# EAGLE design KBV2R20 (EAGLE 5.10)
DIGIKEY: S1064-ND; DIGIKEY#: PS1240P02CT3; MOUSER: PS1240P02CT3; MOUSER#: 263-1.0K-RC; NEWARK#: 89H0684

## Sheet 1 of 2
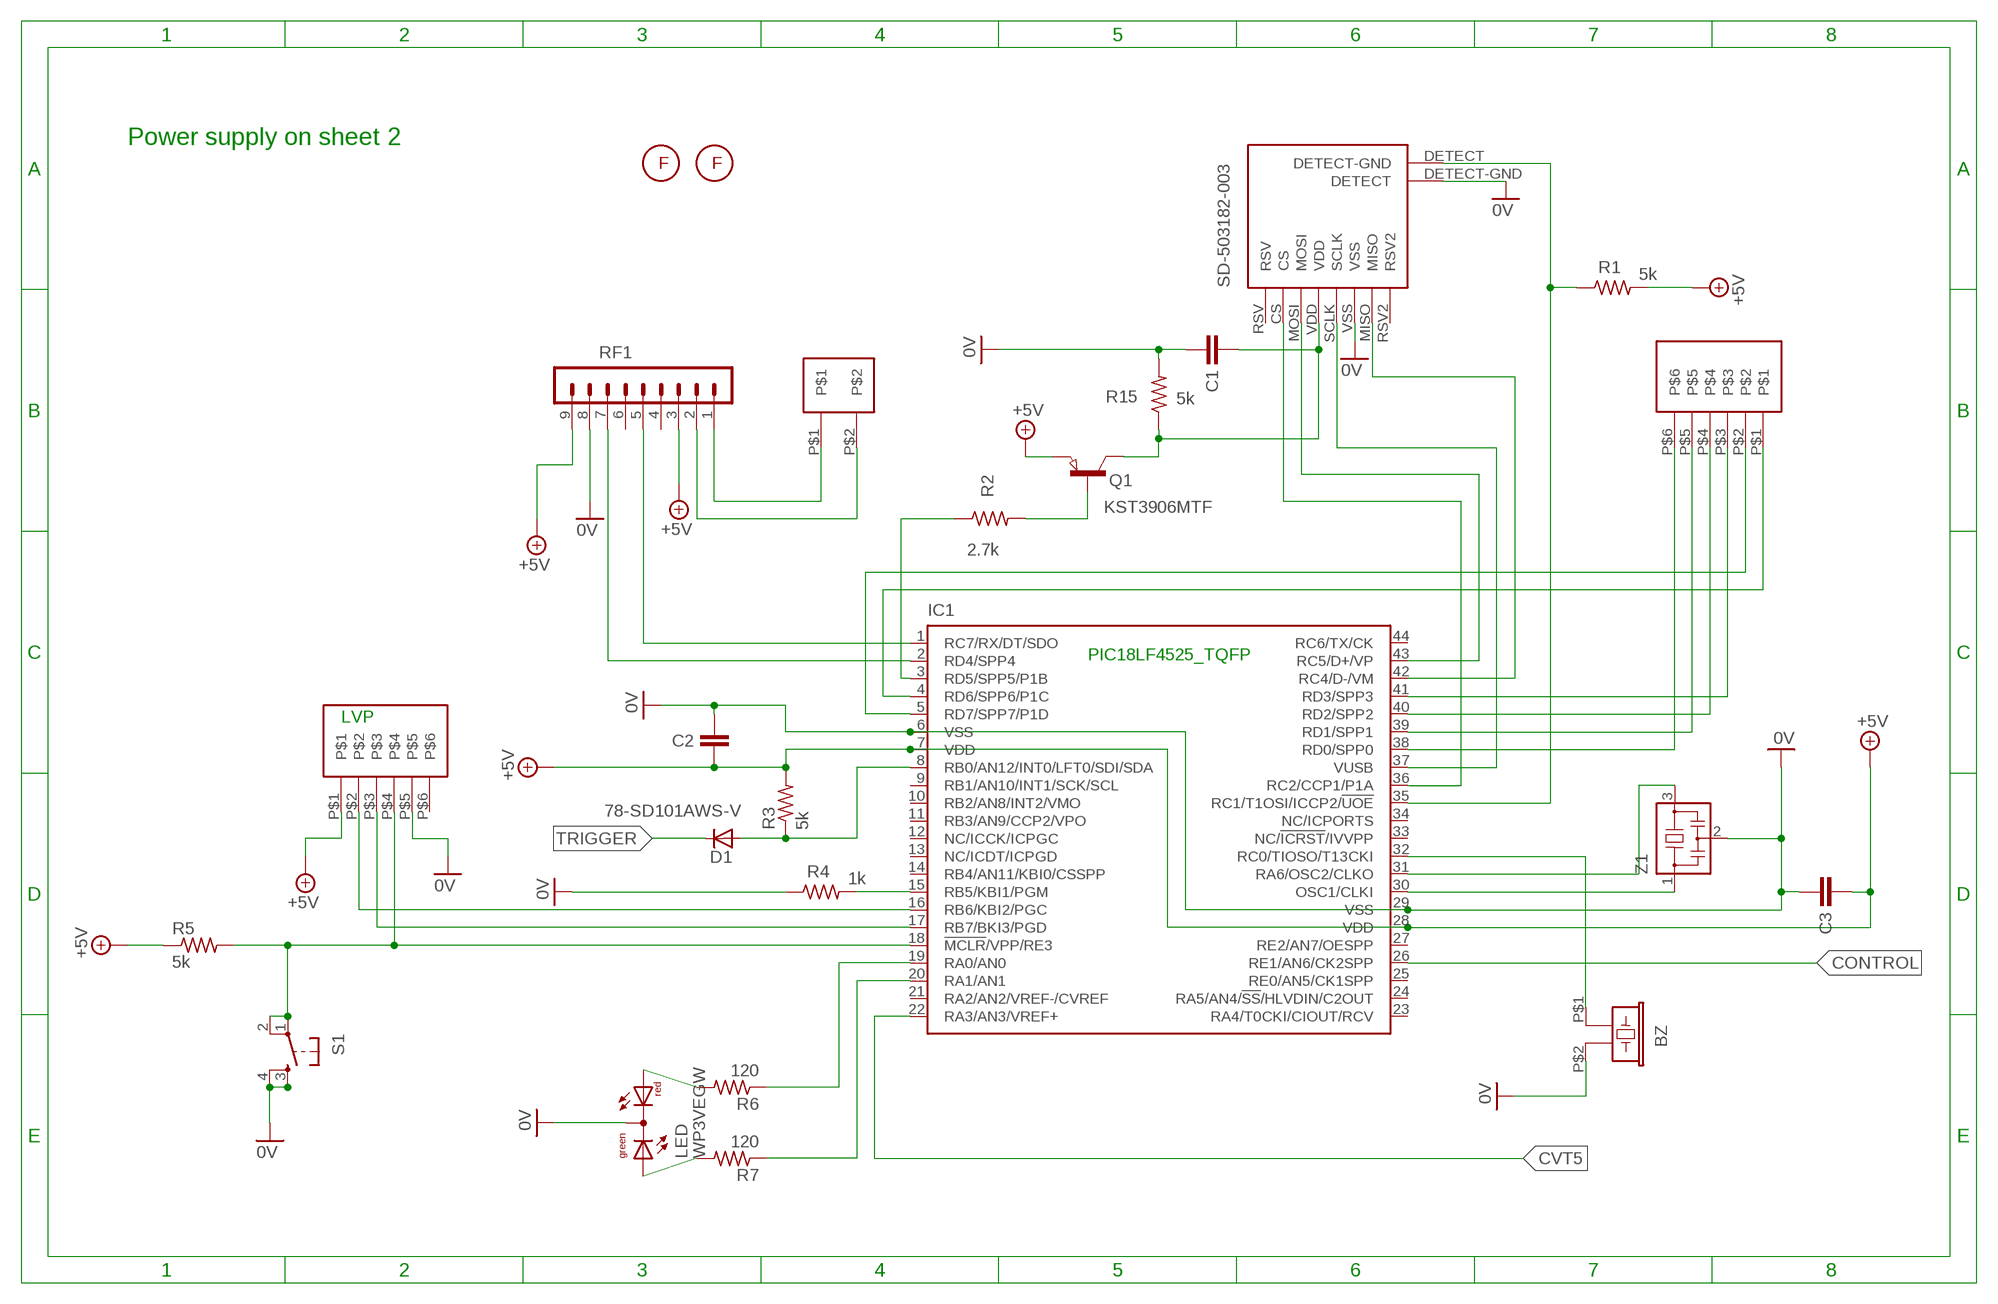
[diagram p0: schematic, sheet 1]

### Parts
BZ  PS1240P02CT3  HP1360A  [HP1360A]
C1  .1 uf  C-EUC0805K  [C0805K]
C2  .1 uf  C-EUC0805K  [C0805K]
C3  .1 uf  C-EUC0805K  [C0805K]
D1  78-SD101AWS-V  DIODE-SOD323-W  [SOD323-W]
EC-B  EZC06DRXH_BOTTOM  [EZC06DRXH_BOTTOM]
EC-T  EZC06DRXH_TOP  [EZC06DRXH_TOP]
FM1  FIDUCIAL2MMCIRCLE  [FIDUCIAL_2MMCIRCLE]
FM2  FIDUCIAL2MMCIRCLE  [FIDUCIAL_2MMCIRCLE]
IC1  PIC18F4525_TQFP Newark 89H0684  PIC18F4550_TQFP  [TQFP44]
L1  RC1  2PINPAD  [2PINPAD]
LED  WP3VEGW  [DUOLED-A-3MM]
Q1  KST3906MTF  PNP-TRANSISTOR_SOT23  [SOT23]
R1  5k  R-US_R0805  [R0805]
R2  2.7k  R-US_R0805  [R0805]
R3  5k  R-US_R0805  [R0805]
R4  1k  R-US_R0805  [R0805]
R5  5k  R-US_R0805  [R0805]
R6  120  R-US_R0805  [R0805]
R7  120  R-US_R0805  [R0805]
R15  5k  R-US_R0805  [R0805]
RF1  MA09-1  [MA09-1]
S1  DTS-6  [DTS-6]
SD1  SD-503182-003R  [SD-503182-003]
Z1  CSTCR4M00G53-R0  CSTCR6M00G53Z  [CSTCR6M]

### Nets
+5V: C2.2 C3.2 EC-T.P$1 IC1.7(VDD) IC1.28(VDD) Q1.2(E) R1.2 R3.2 R5.1 RF1.3 RF1.9 ; also sheet 2
CONTROL: IC1.26(RE1/AN6/CK2SPP) ; also sheet 2
CVT5: IC1.22(RA3/AN3/VREF+) ; also sheet 2
GND [GND]: BZ.P$2 C1.1 C2.1 C3.1 EC-T.P$5 IC1.6(VSS) IC1.29(VSS) LED.2(C) R4.1 R15.2 RF1.8 S1.3 S1.4 SD1.DETECT-GND(DETECT) SD1.VSS Z1.2 ; supply symbol labelled 0V ; also sheet 2
N$1: C1.2 Q1.3(C) R15.1 SD1.VDD
N$3: IC1.30(OSC1/CLKI) Z1.1
N$4: BZ.P$1 IC1.32(RC0/TIOSO/T13CKI)
N$5: L1.P$2 RF1.2
N$6: L1.P$1 RF1.1
N$7: IC1.3(RD5/SPP5/P1B) R2.1
N$8: Q1.1(B) R2.2
N$10: IC1.19(RA0/AN0) R6.1
N$11: IC1.20(RA1/AN1) R7.1
N$14: IC1.15(RB5/KBI1/PGM) R4.2
N$15: EC-T.P$3 IC1.17(RB7/BKI3/PGD)
N$17: EC-T.P$4 IC1.18(!MCLR!/VPP/RE3) R5.2 S1.1 S1.2
N$18: EC-T.P$2 IC1.16(RB6/KBI2/PGC)
N$19: IC1.31(RA6/OSC2/CLKO) Z1.3
N$20: IC1.1(RC7/RX/DT/SDO) RF1.5
N$21: IC1.2(RD4/SPP4) RF1.7
N$22: EC-B.P$1 IC1.4(RD6/SPP6/P1C)
N$23: IC1.42(RC4/D-/VM) SD1.MISO
N$24: LED.3(AG) R7.2
N$25: LED.1(AR) R6.2
N$26: IC1.37(VUSB) SD1.SCLK
N$30: EC-B.P$2 IC1.5(RD7/SPP7/P1D)
N$31: EC-B.P$3 IC1.41(RD3/SPP3)
N$32: EC-B.P$4 IC1.40(RD2/SPP2)
N$33: EC-B.P$5 IC1.39(RD1/SPP1)
N$34: EC-B.P$6 IC1.38(RD0/SPP0)
N$35: IC1.36(RC2/CCP1/P1A) SD1.CS
N$36: IC1.35(RC1/T1OSI/ICCP2/!UOE) R1.1 SD1.DETECT(DETECT-GND)
N$37: IC1.43(RC5/D+/VP) SD1.MOSI
RB4: D1.A IC1.8(RB0/AN12/INT0/LFT0/SDI/SDA) R3.1
TRIGGER: D1.C ; also sheet 2
Unconnected: EC-T.P$6 IC1.9(RB1/AN10/INT1/SCK/SCL) IC1.10(RB2/AN8/INT2/VMO) IC1.11(RB3/AN9/CCP2/VPO) IC1.12(NC/ICCK/ICPGC) IC1.13(NC/ICDT/ICPGD) IC1.14(RB4/AN11/KBI0/CSSPP) IC1.21(RA2/AN2/VREF-/CVREF) IC1.23(RA4/T0CKI/CIOUT/RCV) IC1.24(RA5/AN4/!SS!/HLVDIN/C2OUT) IC1.25(RE0/AN5/CK1SPP) IC1.27(RE2/AN7/OESPP) IC1.33(NC/!ICRST!/IVVPP) IC1.34(NC/ICPORTS) IC1.44(RC6/TX/CK) RF1.4 RF1.6 SD1.RSV SD1.RSV2

### Notes on the sheet
- Power supply on sheet 2
- PIC18LF4525_TQFP
- LVP

## Sheet 2 of 2
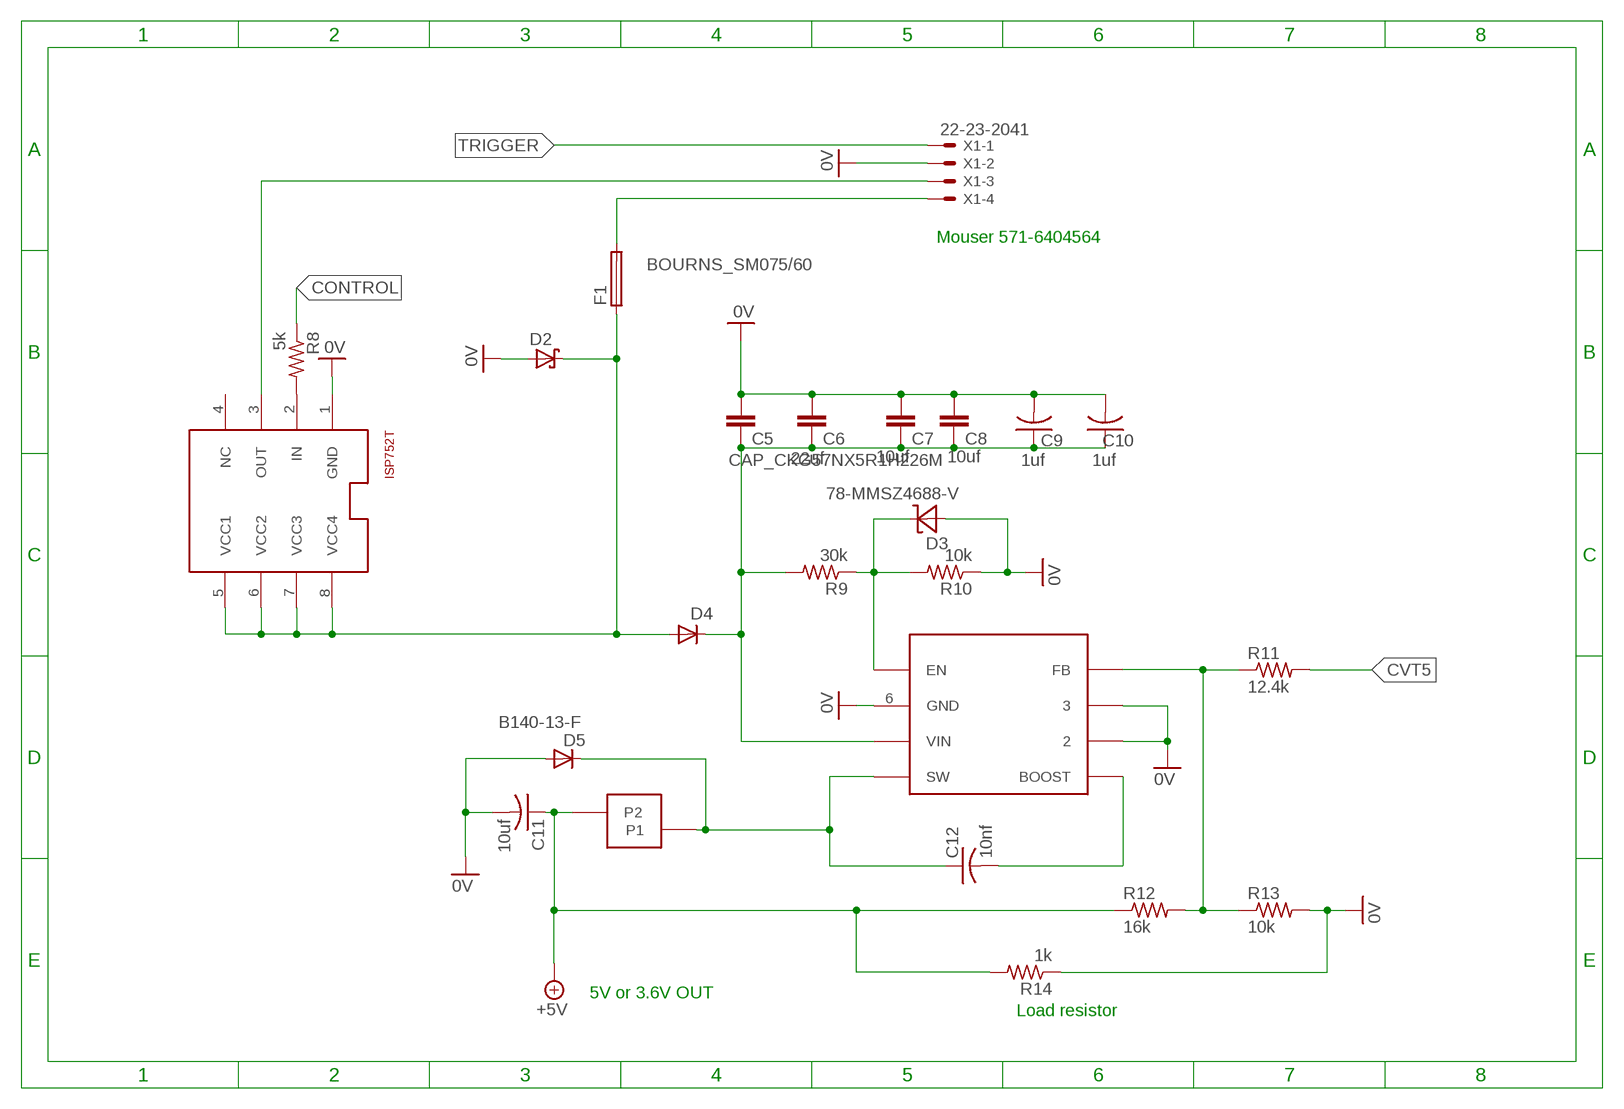
[diagram p1: schematic, sheet 2]

### Parts
C5  CAP_CKG57NX5R1H226M  [CKG57]
C6  22uf  CAP_CKG57NX5R1H226M  [CKG57]
C7  10uf  C-EUC1210  [C1210]
C8  10uf  C-EUC1210  [C1210]
C9  1uf  C-USC1206  [C1206]
C10  1uf  C-USC0805K  [C0805K]
C11  10uf  C-USC1210  [C1210]
C12  10nf  C-USC0805K  [C0805K]
D2  M 863-1SMC28AT3G  SCHOTTKY-DIODESMD  [SMB]
D3  78-MMSZ4688-V  Z-DIODE  [SOD123@1]
D4  M 522-ZHCS400TA  DIODE-SOD323-W  [SOD323-W]
D5  B140-13-F  CGRM4001-G  [SOD-123_MINI-SMA]
F1  BOURNS_SM075/60  [BOURNS_SM075/60]
L2  667-ELL-6UH271M  [667-ELL-6UH271M]
R8  5k  R-US_R0805  [R0805]
R9  30k  R-US_R0805  [R0805]
R10  10k  R-US_R0805  [R0805]
R11  12.4k  R-US_R0805  [R0805]
R12  16k  R-US_R0805  [R0805]
R13  10k  R-US_R0805  [R0805]
R14  1k  R-US_R0805  [R0805]
S2  ISP752T  [SO8]
VR  LM22674  [LM22674]
X1  22-23-2041  [22-23-2041]

### Nets
+5V: C11.1 L2.P$2(P2) R12.1 R14.2 ; also sheet 1
CONTROL: R8.1 ; also sheet 1
CVT5: R11.2 ; also sheet 1
ENABLE_OUT: S2.3(OUT) X1.3
GND [GND]: C5.P$1 C6.P$1 C7.1 C8.1 C9.2 C10.2 C11.2 D2.A D3.A D5.A R10.1 R13.2 R14.1 S2.1(GND) VR.2 VR.3 VR.6(GND) X1.2 ; supply symbol labelled 0V ; also sheet 1
N$2: R8.2 S2.2(IN)
N$13: C12.2 VR.1(BOOST)
N$16: C12.1 D5.C L2.P$1(P1) VR.8(SW)
N$27: C5.P$2 C6.P$2 C7.2 C8.2 C9.1 C10.1 D4.C R9.2 VR.7(VIN)
N$28: D3.C R9.1 R10.2 VR.5(EN)
N$29: R11.1 R12.2 R13.1 VR.4(FB)
P1: D2.C D4.A F1.P$1 S2.5(VCC1) S2.6(VCC2) S2.7(VCC3) S2.8(VCC4)
P_IN: F1.P$2 X1.4
TRIGGER: X1.1 ; also sheet 1
Unconnected: S2.4(NC)

### Notes on the sheet
- Mouser 571-6404564
- 5V or 3.6V OUT
- Load resistor

## Library data of the parts
BZ = buzzer:HP1360A: HP1360A Piezo Buzzer
C1-C3 = resistor:C-EU: CAPACITOR, European symbol
C5 C6 = capacitor-wima:CAP_CKG57NX5R1H226M: Multilayer Ceramic Capacitors (MLCC)
C7 C8 = rcl:C-EU: CAPACITOR, European symbol
C9-C12 = resistor:C-US: CAPACITOR, American symbol
D1 D4 = diode:DIODE-: DIODE
D2 = diode:SCHOTTKY-DIODE: Schottky Diode
D3 = diode:Z-DIODE: SOD123
D5 = diode:CGRM400*-G: Molded plasitc,JEDEC SOD-123/Mini SMA Source: Comchip CGRM4001-G.pdf
EC-B = special:EZC06DRXH_BOTTOM: CONN EDGE DUAL .100 DIP 12POS
EC-T = special:EZC06DRXH_TOP: CONN EDGE DUAL .100 DIP 12POS
F1 = fuse:BOURNS_SM075/60: PTC Resettable Fuses 60volt 10Amp Hold 0.75 Trip 1.6
FM1 FM2 = pickplace:FIDUCIAL: Fiducial marks
IC1 = microchip:PIC18F4*_TQFP: USB Microcontrollers with nanoWatt Technology High-Performance, Enhanced Flash, 28/40/44-Pin, Source: http://ww1.microchip.com/downloads/en/devicedoc/39632c.pdf
L1 = Misc:2PINPAD
L2 = Keybuster:667-ELL-6UH271M: SMD Choke Coil
LED = led:WP3VEGW: Red-Green dual LED
Q1 = semicon-smd-ipc:PNP-TRANSISTOR_: PNP TRANSISTOR
R1 R2 R4 R15 = resistor:R-US_: RESISTOR, American symbol
R3 R5-R14 = rcl:R-US_: RESISTOR, American symbol
RF1 = con-lstb:MA09-1: PIN HEADER
S1 = switch-tact:DTS-6
S2 = zetex:ISP752T: High side switch
SD1 = MolexSD:SD-503182-003R: Molex Micro-SD card socket
VR = Keybuster:LM22674: 500 mA SIMPLE SWITCHER®, Step-Down Voltage Regulator with Precision Enable
X1 = con-molex:22-23-2041: .100" (2.54mm) Center Header - 4 Pin
Z1 = murata-filter:CSTCR: Resonator Source: murata.co.jp

## Net classes
0 default: width 0.203 mm
1 GND: width 0.635 mm

## Board
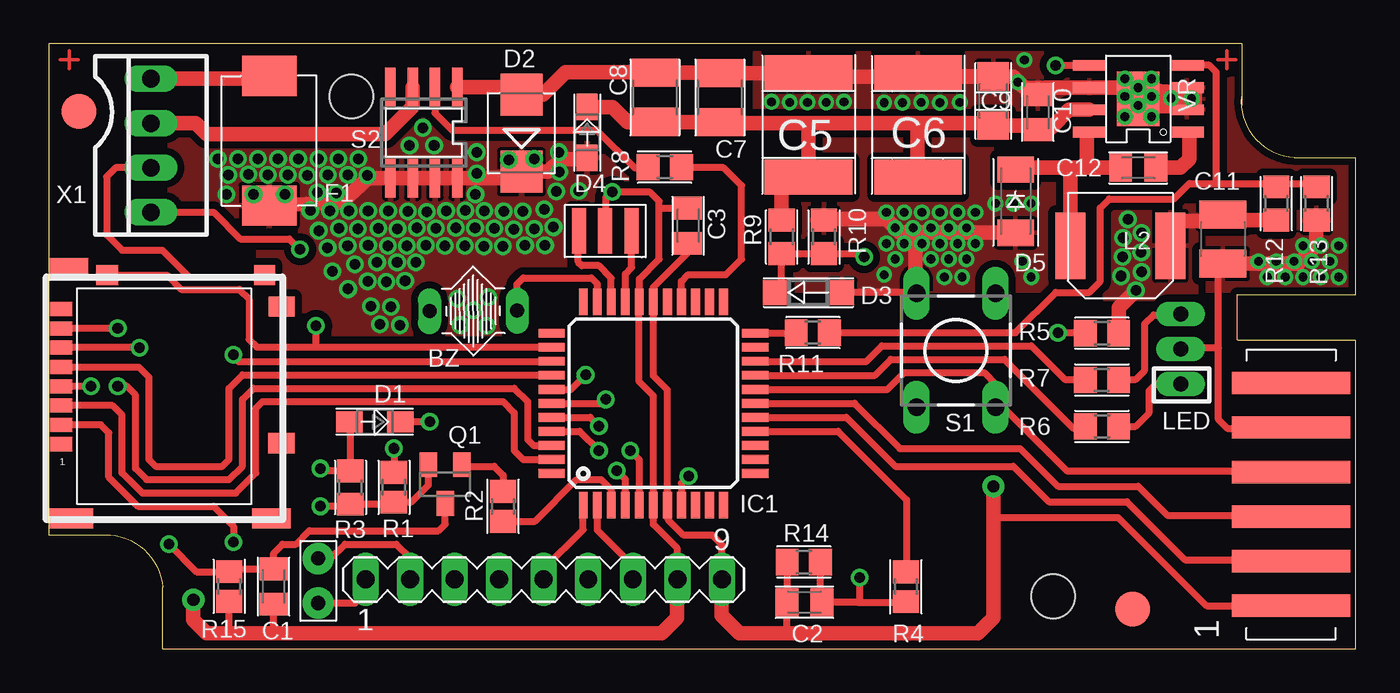
[diagram p2: board, top side]
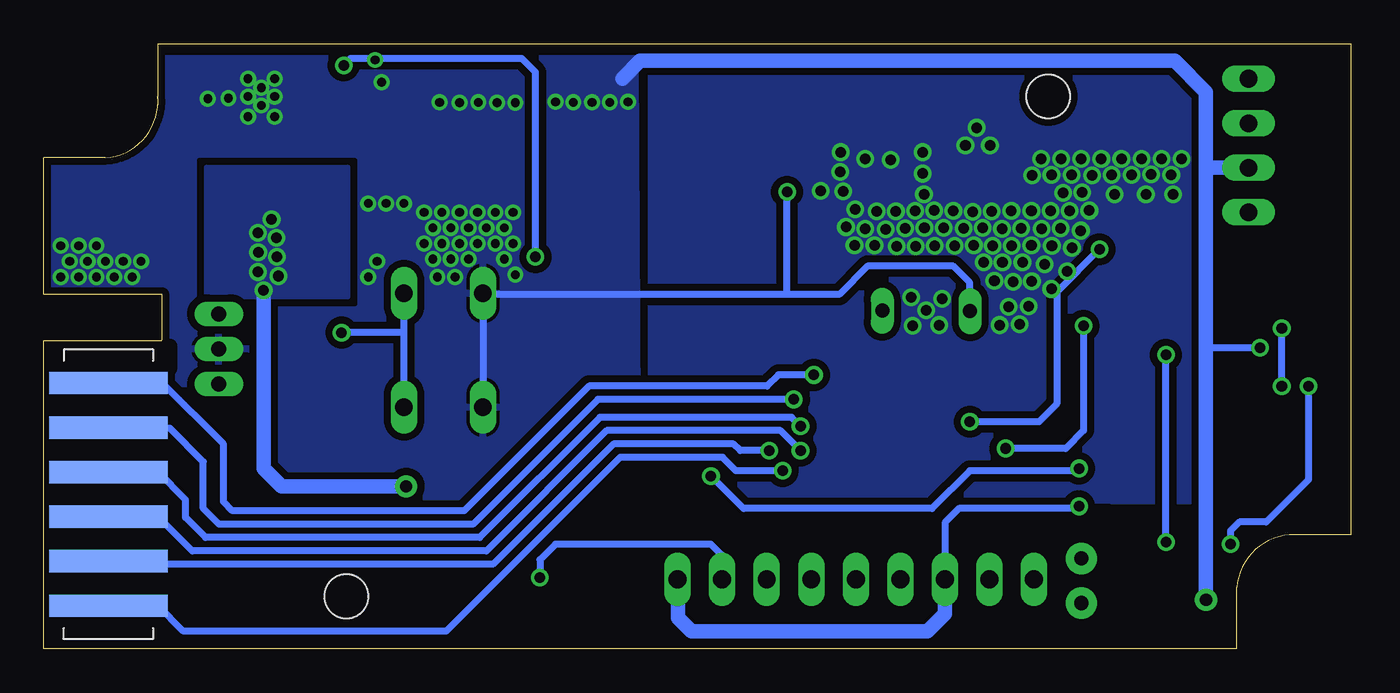
[diagram p3: board, bottom side, seen from below]

Size 74.5 x 34.5 mm. Coordinates in mm from the lower left corner, seen from the top.
Copper layers (1*16): Top 0.035mm / dielectric 1.5mm / Bottom 0.035mm
Design rules "default *": minimum track width 12mil, minimum drill 15mil, track to track 8mil, track to pad 8mil, pad to pad 8mil, via to via 8mil, smd to smd 8mil, copper to edge 8mil, drill to drill 8mil, minimum pad ring 10mil, minimum via ring 8mil, stop-mask expansion 4mil, vias tented up to drill 0mil, thermal gap 8mil
tRestrict: area 67.6,16 to 74,17.4; area 67.4,13.3 to 74.2,14.5; area 67.4,10.8 to 74.2,11.9; area 67.4,8.3 to 74.2,9.4; area 67.4,5.7 to 74.2,6.9; area 67.6,3.2 to 74.3,4.3; area 67.6,0.3 to 74.3,1.7
bRestrict: area 67.3,16 to 74.4,17.3; area 67.4,13.3 to 74.2,14.5; area 67.4,10.8 to 74.2,11.9; area 67.4,8.3 to 74.2,9.4; area 67.4,5.7 to 74.2,6.9; area 67.4,3.2 to 74.2,4.3

### Footprints (pad centres in the part's own frame; a part is rotated, then mirrored left to right if it is on the bottom)
HP1360A = drill 0.8 long: P$1 -2.5,0; P$2 2.5,0
C0805K = smd 1.3 x 1.6: 1 -1,0; 2 1,0
CKG57 = smd 2 x 5: P$1 1,-2.5; P$2 6.95,-2.5
C1210 = smd 1.6 x 2.7: 1 -1.4,0; 2 1.4,0
C1206 = smd 1.6 x 1.8: 1 -1.4,0; 2 1.4,0
SOD323-W = smd 1.5 x 1.2: A 1.45,0; C -1.45,0
SMB = smd 2.4 x 2.4: A 2.2,0; C -2.2,0
SOD123@1 = smd 1.4 x 1.4: A 1.9,0; C -1.9,0
SOD-123_MINI-SMA = smd 1.5 x 2.1: A 1.8,0; C -1.8,0
EZC06DRXH_BOTTOM = smd 6.731 x 1.27 bottom: P$1 0,-6.35; P$2 0,-3.81; P$3 0,-1.27; P$4 0,1.27; P$5 0,3.81; P$6 0,6.35
EZC06DRXH_TOP = smd 6.731 x 1.27: P$1 0,-6.35; P$2 0,-3.81; P$3 0,-1.27; P$4 0,1.27; P$5 0,3.81; P$6 0,6.35
BOURNS_SM075/60 = smd 2.3 x 3.1: P$1 0,0; P$2 7.4,0
FIDUCIAL_2MMCIRCLE = smd 2 x 2: P$1 0,0
TQFP44 = smd 1.5 x 0.5: 1 -5.8,4; 2 -5.8,3.2; 3 -5.8,2.4; 4 -5.8,1.6; 5 -5.8,0.8; 6 -5.8,0; 7 -5.8,-0.8; 8 -5.8,-1.6; 9 -5.8,-2.4; 10 -5.8,-3.2; 11 -5.8,-4; 23 5.8,-4; 24 5.8,-3.2; 25 5.8,-2.4; 26 5.8,-1.6; 27 5.8,-0.8; 28 5.8,0; 29 5.8,0.8; 30 5.8,1.6; 31 5.8,2.4; 32 5.8,3.2; 33 5.8,4 | smd 0.5 x 1.5: 12 -4,-5.8; 13 -3.2,-5.8; 14 -2.4,-5.8; 15 -1.6,-5.8; 16 -0.8,-5.8; 17 0,-5.8; 18 0.8,-5.8; 19 1.6,-5.8; 20 2.4,-5.8; 21 3.2,-5.8; 22 4,-5.8; 34 4,5.8; 35 3.2,5.8; 36 2.4,5.8; 37 1.6,5.8; 38 0.8,5.8; 39 0,5.8; 40 -0.8,5.8; 41 -1.6,5.8; 42 -2.4,5.8; 43 -3.2,5.8; 44 -4,5.8
2PINPAD = drill 0.8 pad 1.778 round: P$1 0,0; P$2 2.54,0
667-ELL-6UH271M = smd 1.7 x 3.8: P$1 2.85,0; P$2 -2.85,0
DUOLED-A-3MM = drill 0.85 pad 1.4 long: 1 -2,0; 2 0,0; 3 2,0
SOT23 = smd 1 x 1.4: 1 -0.95,-1.1; 2 0.95,-1.1; 3 0,1.1
R0805 = smd 1.3 x 1.5: 1 -0.85,0; 2 0.85,0
R0805' = smd 1.3 x 1.5: 1 -0.95,0; 2 0.95,0
MA09-1 = drill 1.016 long: 1 -10.16,0; 2 -7.62,0; 3 -5.08,0; 4 -2.54,0; 5 0,0; 6 2.54,0; 7 5.08,0; 8 7.62,0; 9 10.16,0
DTS-6 = drill 1 long: 1 -3.25,2.25; 2 3.25,2.25; 3 -3.25,-2.25; 4 3.25,-2.25
SO8 = smd 0.6 x 2.2: 1 -1.905,-2.6; 2 -0.635,-2.6; 3 0.635,-2.6; 4 1.905,-2.6; 5 1.905,2.6; 6 0.635,2.6; 7 -0.635,2.6; 8 -1.905,2.6
SD-503182-003 = smd 1.24 x 0.8: CS -13.11,5.97; MISO -13.11,11.47; MOSI -13.11,7.07; RSV -13.11,4.87; RSV2 -13.11,12.57; SCLK -13.11,9.27; VDD -13.11,8.17; VSS -13.11,10.37 | smd 1.25 x 1.16: DETECT -10.48,14.51 | smd 1.2 x 1.16: DETECT-GND -1.52,14.51 | smd 1.5 x 1.15: NC1 -0.55,12.71; NC2 -0.56,4.93 | smd 2.2 x 1.15: NC3 -1.14,0.63; NC5 -12.66,14.91 | smd 2.5 x 1.15: NC4 -12.53,0.63
KBV2 = hole 2.5: 17.25,31.5; 57.25,3
LM22674 = smd 0.61 x 1.91: 1 -1.905,-2.78; 2 -0.635,-2.78; 3 0.635,-2.78; 4 1.905,-2.78; 5 1.905,2.78; 6 0.635,2.78; 7 -0.635,2.78; 8 -1.905,2.78 | smd 3.1 x 2.41: PAD 0,0
22-23-2041 = drill 1 long: 1 -3.81,0; 2 -1.27,0; 3 1.27,0; 4 3.81,0
CSTCR6M = smd 0.8 x 2.6: 1 -1.5,0; 2 0,0; 3 1.5,0

### Placement (x,y rotation side)
BZ  24.21,19.27 180.3 top
C1  12.83,3.56 90 top
C2  43.08,2.66 180 top
C3  36.45,24.13 270 top
C5  45.81,33.86 270 top
C6  52.06,33.85 270 top
C7  38.26,31.44 270 top
C8  34.55,31.45 270 top
C9  53.85,31.24 90 top
C10  56.39,30.61 90 top
C11  66.93,23.37 270 top
C12  62.1,27.43 0 top
D1  18.59,12.94 180 top
D2  26.95,29.41 90 top
D3  43.31,20.32 0 top
D4  30.7,29.45 270 top
D5  55.12,25.53 270 top
EC-B  70.82,8.81 0 top
EC-T  70.82,8.81 0 top
F1  12.57,25.27 90 top
FM1  1.73,30.66 0 top
FM2  61.8,2.26 0 top
IC1  34.47,14 90 top
L1  15.37,2.61 90 top
L2  61.09,22.99 180 top
LED  64.53,17.09 90 top
Q1  22.61,9.4 180 top
R1  19.68,9.22 270 top
R2  25.91,8.13 90 top
R3  5k  [R0805']  17.21,9.21 270 top
R4  48.87,3.55 90 top
R5  5k  [R0805']  60.04,18 180 top
R6  120  [R0805']  60.04,12.69 0 top
R7  120  [R0805']  60.04,15.34 0 top
R8  5k  [R0805']  35.12,27.47 180 top
R9  30k  [R0805']  41.78,23.5 90 top
R10  10k  [R0805']  44.2,23.5 270 top
R11  12.4k  [R0805']  43.56,18.03 180 top
R12  16k  [R0805']  69.98,25.4 90 top
R13  10k  [R0805']  72.26,25.4 270 top
R14  1k  [R0805']  43.05,4.95 180 top
R15  10.29,3.56 270 top
RF1  28.22,3.96 0 top
S1  51.72,17.02 270 top
S2  21.39,29.44 180 top
SD1  13.83,6.8 0 top
U$1  [KBV2]  0,0 0 top
U$2  [CROSSHAIR_8MIL]  1.17,33.6 0 top
U$3  [CROSSHAIR_8MIL]  67.16,33.6 0 top
VR  62.1,31.37 90 top
X1  5.84,28.7 90 top
Z1  31.72,23.83 180 top

### Tracks (layer width: path | path; a pad name or v marks a point on that pad's centre or on a via)
+5V  (via drill 0.6, 0.7 pad 1.27)
  Top 0.406: RF1.9 38.38,5.94 37.85,6.48 36.2,6.48 35.31,7.37 35.31,8.16 IC1.7 35.27,14.77 34.47,15.57 IC1.28 34.47,20.63 36.45,22.61 C3.2 | R14.2 42.1,2.81 42.23,2.81 C2.2 42.08,1.06 41.66,0.89 | EC-T.P$1 65.99,2.46 60.96,7.49 53.85,7.49 | R3.2 17.21,8.15 | R3.2 19.07,8.26 R1.2 | v15.49,8.13 17.08,8.13 R3.2 | R1.2 19.8,8.26 | R1.2 19.7,8.38 20.7,8.38 21.66,9.34 Q1.2
  Top 0.813: 63.88,24.13 63.88,23.04 L2.P$2 | 63.88,24.13 63.88,24.38 66.93,24.38 C11.1 67.25,24.45 R12.1 | 63.88,24.13 63.75,24.26 | RF1.9 38.35,3.94 38.35,1.91 39.37,0.89 41.66,0.89 52.96,0.89 53.85,1.78 53.85,7.49 v53.85,9.27 | R5.1 60.99,19.46 v61.98,20.45
  Bottom 0.406: RF1.3 23.14,7.21 22.35,8 15.62,8 v15.49,8.13
  Bottom 0.813: v53.85,9.27 60.96,9.27 61.98,10.29 v61.98,20.45 | RF1.3 23.14,2.01 24.13,1.02 37.59,1.02 38.35,1.78 38.35,3.94 RF1.9
  other vias: 62.28,22.61 61.21,22.35 62.31,21.49 61.14,21.26 62.31,23.72 61.24,23.44 61.52,24.49
  pour Top (isolate 0.406): 60.2,25.27 65.41,25.27 65.41,24.38 65.41,19.94 60.2,19.94
  pour Bottom (isolate 0.406): 57.15,27.46 65.25,27.46 65.25,20.07 57.15,20.07
CONTROL
  Top 0.406: IC1.26 36.07,20.96 36.45,21.34 38.61,21.34 39.5,22.23 39.5,26.42 38.48,27.43 36.1,27.43 R8.1
CVT5
  Top 0.406: IC1.22 42.58,18 R11.2
ENABLE_OUT
  Top 0.813: X1.3 8.38,29.97 9.02,29.34 19.18,29.34 20.75,30.91 S2.3
GND  (via drill 0.5 pad 0.25, 0.6, 0.7 pad 1.27)
  Top 0.254: 55.63,32 56.39,32 C10.2
  Top 0.406: SD1.DETECT-GND 12.2,21.21 8,21.21 6.48,22.73 4.19,22.73 3.3,23.62 3.3,26.92 3.81,27.43 X1.2 | SD1.VSS v5.18,17.17 5.21,17.14 | 61.47,32 61.59,32 61.72,32.13 | EC-T.P$5 70.81,12.61 | RF1.8 35.84,5.73 34.48,7.09 IC1.6 34.47,14.43 33.66,15.24 33.66,19.79 IC1.29 33.67,21.1 34.8,22.23 34.8,25.15 | 46.1,2.66 C2.1 44,2.66 R14.1 | 46.1,2.66 48.87,2.66 R4.1 | D3.A 49.42,20.32 S1.3 | v46.23,4.06 46.23,2.79 46.1,2.66 | 66.67,17.14 64.53,17.14 LED.2 | 66.67,17.14 66.67,13.08 67.18,12.57 70.76,12.57 | 34.8,25.15 34.8,25.53 34.29,26.04 32.03,26.04 31.75,25.76 31.75,23.85 Z1.2 | C3.1 34.81,25.13 34.8,25.15 | R15.2 10.29,1.02 10.41,0.89 | C1.1 12.83,1.02 12.95,0.89 | 66.67,17.14 66.67,21.71 C11.2 | 62.87,32 62.79,32 | 62.87,32 v62.87,32.51 | 63.4,30.73 62.1,30.73 v62.1,30.99 | 63.4,30.73 VR.2 63.7,30.73 63.7,31.7 65.53,31.7 65.53,31.39 | 63.4,32 62.87,32 | 63.4,30.73 63.4,32 | 63.4,32 VR.3 | 65.53,31.09 65.53,30.79 64.01,30.79 64.01,31.39 65.53,31.39 | 65.53,31.39 65.53,31.09 | 65.53,31.09 62.87,31.09 v62.87,31.5
  Top 0.813: C5.P$1 43.29,32.84 41.85,32.84 41.66,32.64 | 50.45,32.86 50.55,32.77 49.64,32.77 C6.P$1 | 54.03,32.85 C9.2 50.67,32.64 | RF1.8 35.81,3.94 35.81,1.78 34.92,0.89 12.95,0.89 10.41,0.89 9.02,0.89 8.25,1.66 v8.25,2.79 v8.26,2.79 | 49.53,23.73 48.54,23.73 47.75,24.51 44.26,24.51 R10.1 | 49.53,23.73 D5.A | 49.42,20.32 49.42,23.62 49.53,23.73 | 62.74,32.13 62.1,31.5 62.1,31.37 61.47,32 VR.6 55.63,32 54.99,32.64 50.67,32.64 | 70.76,12.57 EC-T.P$5 | 41.66,32.64 50.67,32.64 | 41.66,32.64 41.53,32.51 41.53,32.84 C7.1 38.24,32.85 C8.1 34.51,32.89 29.46,32.89 28.18,31.61 D2.A 26.52,32.04 S2.1 | C11.2 71.24,21.97 72.26,22.99 R13.2 | v32.13,26.06 32.13,26.14
  Bottom 0.406: S1.4 S1.3 49.42,20.22 32.11,20.22 | v5.18,17.17 8.23,17.17 8.26,17.14 | v46.23,4.06 46.23,5.08 45.34,5.97 36.47,5.97 35.84,5.33 RF1.8 | 8.26,21.84 | 32.11,20.22 29.16,20.22 27.56,21.82 22.66,21.82 21.72,20.88 BZ.P$2 | v32.13,26.06 32.13,20.24 32.11,20.22
  Bottom 0.813: v8.26,2.79 8.26,17.14 8.26,21.84 8.26,27.43 | 8.26,27.43 8.26,31.75 10.03,33.53 40.51,33.53 41.53,32.51 | 8.26,27.43 X1.2
  other vias: 73.03,22.1 61.34,32.51 62.1,32 61.34,31.5 53.98,25.4 54.99,25.4 56.01,25.4 47.75,24.89 48.77,24.89 49.78,24.89 50.8,24.89 51.82,24.89 48.26,24 49.28,24 50.29,24 51.31,24 52.32,24 52.83,24.89 47.75,23.11 48.77,23.11 49.78,23.11 50.8,23.11 51.82,23.11 52.83,23.11 51.31,22.23 52.32,22.23 50.29,22.23 48.26,22.23 51.05,21.21 52.07,21.21 47.62,21.34 55.5,22.1 56.01,21.21 73.53,21.21 72.52,21.21 71.5,21.21 70.48,21.21 69.47,21.21 72.01,22.1 70.99,22.1 69.98,22.1 68.96,22.1 71.5,22.99 72.52,22.99 73.53,22.99 61.34,30.35 62.87,30.35 41.2,31.19 42.24,31.17 43.26,31.17 44.32,31.17 45.34,31.19 47.62,31.14 48.67,31.14 49.73,31.17 50.8,31.14 51.94,31.17 63.98,31.39 65.15,31.37 55.63,33.58 55.24,32.31
  pour Bottom (isolate 0.406, rank 2): 40.77,33.66 74.3,33.66 74.17,8.76 40.64,8.51
  pour Top (isolate 0.406, rank 2): 40.26,34.04 74.17,34.04 74.17,20.45 40.26,20.45
N$1  (via drill 0.6)
  Top 0.406: SD1.VDD 2.4,14.97 v2.41,14.99 | Q1.3 22.61,7.11 22.23,6.73 14.86,6.73 14.1,5.97 13.34,5.97 12.83,5.46 C1.2 10.44,4.56 R15.1 8.42,4.41 v6.86,5.97
  Bottom 0.406: v2.41,14.99 2.41,9.65 4.83,7.24 6.35,7.24 6.86,6.73 v6.86,5.97
N$2
  Top 0.406: R8.2 34.13,27.43 33.4,27.43 31.24,29.59 22.99,29.59 22.02,30.56 S2.2
N$3
  Top 0.406: IC1.30 32.87,21.38 33.24,21.75 33.24,23.81 Z1.1
N$4
  Top 0.406: IC1.32 31.27,20.82 30.94,21.16 27.05,21.16 26.7,20.8 26.7,19.29 BZ.P$1
N$5
  Top 0.406: L1.P$2 16.07,5.15 16.89,5.97 19.81,5.97 20.57,5.21 20.57,3.99 RF1.2
N$6
  Top 0.406: L1.P$1 17.47,2.61 18.03,3.17 18.03,3.94 RF1.1
N$7
  Top 0.406: IC1.3 32.05,8.22 32.05,9.1 31.49,9.65 30.1,9.65 27.73,7.28 R2.1
N$8
  Top 0.406: Q1.1 23.64,10.41 25.4,10.41 25.91,9.91 R2.2
N$10
  Top 0.406: IC1.19 47.1,15.6 48.01,16.51 54.48,16.51 58.42,12.57 58.98,12.57 R6.1
N$11
  Top 0.406: IC1.20 46.63,16.4 47.5,17.27 56.01,17.27 57.91,15.37 59.05,15.37 R7.1
N$13
  Top 0.254: VR.1 64.76,29.34
  Top 0.305: 65.02,29.32 VR.1
  Top 0.813: C12.2 64.52,27.43 65.02,27.94 65.02,29.32
N$14
  Top 0.406: IC1.15 45,12.4 48.9,8.51 48.9,4.51 R4.2
N$15
  Top 0.406: IC1.17 45.94,14 48.51,11.43 55.37,11.43 57.53,9.27 62.1,9.27 63.75,7.62 70.74,7.62 EC-T.P$3
N$16
  Top 0.254: VR.8 59.82,29.46 59.82,29.34
  Top 0.305: 59.18,29.32 VR.8
  Top 0.813: L2.P$1 58.24,27.25 58.42,27.43 | 58.42,27.43 C12.1 59.44,27.43 59.18,27.69 59.18,29.32 | 58.42,27.43 55.22,27.43 D5.C
N$17  (via drill 0.6)
  Top 0.406: EC-T.P$4 70.87,10.16 58.04,10.16 54.43,13.77 S1.2 53.97,15.11 53.34,15.75 48.77,15.75 47.82,14.8 IC1.18 | R5.2 59.05,18.03 v57.53,18.03
  Bottom 0.406: 53.97,18.03 S1.2 | 53.97,18.03 S1.1 | 53.97,18.03 v57.53,18.03
N$18
  Top 0.406: IC1.16 45.47,13.2 48.26,10.41 54.99,10.41 57.02,8.38 61.47,8.38 64.77,5.08 70.74,5.08 EC-T.P$2
N$19
  Top 0.406: IC1.31 32.07,21.14 31.37,21.84 30.4,21.84 30.18,22.06 30.18,23.79 Z1.3
N$20
  Top 0.406: IC1.1 30.47,6.8 28.22,4.55 RF1.5
N$21
  Top 0.406: IC1.2 31.28,6.76 33.3,4.74 RF1.7
N$22  (via drill 0.6)
  Top 0.406: IC1.4 32.87,9.68 v32.38,10.16
  Bottom 0.406: 70.77,2.41 EC-B.P$1 67.99,2.46 66.55,1.02 51.56,1.02 41.66,10.92 35.81,10.92 35.05,10.16 v32.38,10.16
N$23  (via drill 0.6)
  Top 0.406: SD1.MISO 4.18,18.27 v3.94,18.29 | IC1.42 27.64,11.6 27.3,11.94 27.3,14.1 26.54,14.86 11.68,14.86 11.05,14.22 11.05,10.41 10.29,9.65 5.59,9.65 4.95,10.29 4.95,14.48 4.45,14.99 v3.94,14.99
  Bottom 0.406: v3.94,14.99 v3.94,18.29
N$24
  Top 0.406: LED.3 64.48,19.05 62.99,19.05 62.48,18.54 62.48,15.88 61.98,15.37 61.02,15.37 R7.2
N$25
  Top 0.406: R6.2 61.96,12.69 62.74,13.46 62.74,14.73 63.12,15.11 64.51,15.11 LED.1
N$26
  Top 0.406: IC1.37 28.65,15.62 11.05,15.62 10.29,14.86 10.29,10.79 9.91,10.41 6.1,10.41 5.71,10.79 5.71,15.49 5.14,16.07 SD1.SCLK
N$27
  Top 0.254: 42.04,26.92 43.31,26.92 C5.P$2
  Top 0.406: 41.91,26.92 42.04,26.92 41.78,26.67 | 43.29,26.92 C5.P$2
  Top 0.813: 37.59,29.97 38.19,29.97 | 34.56,30.04 C7.2 38.19,29.97 | 34.56,30.04 C8.2 | 38.19,29.97 43.31,29.97 | 43.31,29.97 49.53,29.97 | 49.53,29.97 53.85,29.97 C9.1 56.15,29.84 C10.1 | 43.29,26.92 43.31,26.92 43.31,29.97 | C6.P$2 49.53,26.89 49.53,29.97 | 41.78,26.67 R9.2 | C10.1 56.63,29.59 | VR.7 58.17,30.73 57.15,29.72 56.5,29.72 C10.1 | 34.56,30.04 33.01,30.04 32.16,30.89 30.71,30.89 D4.C
N$28  (via drill 0.6)
  Top 0.406: 46.42,22.29 v46.48,22.35 46.29,22.55 R10.2 R9.1 41.78,20.7 D3.C | VR.5 59.56,33.27 | VR.5 59.94,33.27 | v57.4,33.27 VR.5
  Bottom 0.406: v46.48,22.35 46.48,32.89 47.24,33.66 57.02,33.66 v57.4,33.27
N$29
  Top 0.406: VR.4 66.17,33.27 66.55,32.89 66.55,26.54 | R11.1 55.12,18.03 57.4,20.32 59.31,20.32 59.94,20.95 59.94,25.15 60.45,25.65 64.14,25.65 65.02,26.54 66.55,26.54 | 66.55,26.54 70.1,26.54 | 70.1,26.54 72.07,26.54 R13.1 | R12.2 69.98,26.42 70.1,26.54
N$30  (via drill 0.6)
  Top 0.406: IC1.5 33.67,10.78 v33.15,11.3
  Bottom 0.406: v33.15,11.3 34.8,11.3 35.18,11.68 42.04,11.68 48.9,4.83 70.82,4.83 EC-B.P$2
N$31  (via drill 0.6)
  Top 0.406: IC1.41 30.27,12.4 v31.37,11.3
  Bottom 0.406: v31.37,11.3 32.51,12.45 42.42,12.45 49.28,5.59 66.04,5.59 67.99,7.54 EC-B.P$3
N$32  (via drill 0.6)
  Top 0.406: IC1.40 30.87,13.2 v31.37,12.7
  Bottom 0.406: v31.37,12.7 31.88,13.21 42.8,13.21 49.66,6.35 65.28,6.35 66.42,7.49 66.42,8.51 67.99,10.08 EC-B.P$4
N$33  (via drill 0.6)
  Top 0.406: IC1.39 31.53,14 v31.75,14.22
  Bottom 0.406: EC-B.P$5 71.33,12.62 71.37,12.57 67.31,12.57 65.41,10.67 65.41,8 64.52,7.11 50.04,7.11 42.93,14.22 v31.75,14.22
N$34  (via drill 0.6)
  Top 0.406: IC1.38 29.79,14.8 v30.61,15.62
  Bottom 0.406: v30.61,15.62 32.64,15.62 33.27,14.99 43.43,14.99 50.55,7.87 63.75,7.87 64.26,8.38 64.26,11.68 67.69,15.11 72.26,15.11 72.14,15.24 72.01,15.24 71.93,15.16 EC-B.P$6
N$35  (via drill 0.6)
  Top 0.406: IC1.36 10.78,16.4 v10.54,16.76 | SD1.CS 2.98,12.77 3.43,12.32 3.43,9.78 5.08,8.13 9.4,8.13 10.54,6.99 v10.54,6.1
  Bottom 0.406: v10.54,6.1 v10.54,16.76
N$36  (via drill 0.6)
  Top 0.406: SD1.DETECT 6.75,21.31 7.57,20.5 10.87,20.5 11.43,19.94 11.43,17.65 11.88,17.2 15.24,17.2 | v19.68,11.43 R1.1 | 15.24,17.2 IC1.35 | 15.24,17.2 v15.24,18.41
  Bottom 0.406: v19.68,11.43 16.26,11.43 15.24,12.45 v15.24,18.41
N$37
  Top 0.406: IC1.43 27.05,10.79 26.54,11.3 26.54,13.46 25.91,14.1 12.19,14.1 11.81,13.72 11.81,10.03 10.67,8.89 5.33,8.89 4.19,10.03 4.19,13.34 3.65,13.87 SD1.MOSI
P1  (via drill 0.6)
  Top 0.406: F1.P$1 v11.68,25.91 11.43,25.4
  Top 0.813: F1.P$1 16.69,25.45 18.2,26.84 S2.5 S2.6 S2.7 S2.8 26.95,26.84 D2.C 28.48,27.21 29.21,27.94 30.64,27.94 D4.A
  other vias: 27.69,27.94 17.65,27.94 19.35,24.97 20.47,24.94 21.56,24.92 22.66,24.97 26.24,27.89 24.33,25.91 16.51,27.94 15.37,27.94 14.22,27.94 13.08,27.94 11.94,27.94 10.79,27.94 9.65,27.94 10.13,25.91 10.24,27.03 15.32,26.04 15.93,27.03 17.07,27.03 16.41,26.01 16.03,24.97 14.91,24.99 17.12,24.97 18.21,24.97 17.63,23.95 16.54,23.98 18.8,23.98 23.22,24 23.75,24.99 24.41,27.1 24.84,24.97 25.93,24.94 27.03,24.94 28.24,25.07 28.93,26.09 29.11,27.2 29.08,28.32 24.41,28.32 30.23,26.11 19.51,19.51 18.21,23.01 17.04,22.99 19.33,22.99 18.36,19.53 18.87,18.52 20.02,18.47 21.97,28.7 20.57,28.7 11.38,27.05 12.5,27.03 13.64,27.03 14.76,27 18.16,27 19.89,23.95 20.98,24 22.07,23.98 24.31,24 26.52,23.93 28.78,24.05 27.15,23.01 25.4,23.98 20.42,22.99 21.49,23.01 22.58,22.99 23.72,22.99 24.82,22.96 25.88,22.96 18.72,22.05 19.86,22.05 20.93,22.05 18.19,20.95 19.25,20.93 20.32,20.98 23.29,19.96 25.07,20.04 24.21,19.3 23.47,18.47 24.97,18.41 21.34,29.72 27.69,23.95 28.3,23.01 15.39,23.85 15.9,22.86 17.45,21.92 16.18,21.54 17.07,20.52 13.46,25.91
  pour Bottom (isolate 0.406): 0.76,33.53 39.88,33.78 39.88,8.64 0.64,8.38
  pour Top (isolate 0.406): 2.92,30.99 39.24,30.99 39.12,15.24 2.54,15.24 2.67,34.04
P_IN
  Top 0.813: X1.4 12.57,32.51 F1.P$2
RB4  (via drill 0.6)
  Top 0.406: D1.A 17.21,12.88 R3.1 15.63,10.15 v15.49,10.29 | IC1.8 36.07,9.45 v36.47,9.86
  Bottom 0.406: v15.49,10.29 15.62,10.16 21.72,10.16 23.88,8 34.62,8 v36.47,9.86
TRIGGER  (via drill 0.6)
  Top 0.406: X1.1 9.4,24.89 10.92,23.37 13.72,23.37 14.3,22.78 v14.33,22.78 | D1.C 21.45,12.95 v21.72,12.95
  Bottom 0.406: v14.33,22.78 16.76,20.34 16.76,13.97 17.78,12.95 v21.72,12.95

### Text on the board
tPlace: 1
tNames: C6 | C5 | D4
Reference: Encolsure